# Altium project RB2_My.PrjPcb
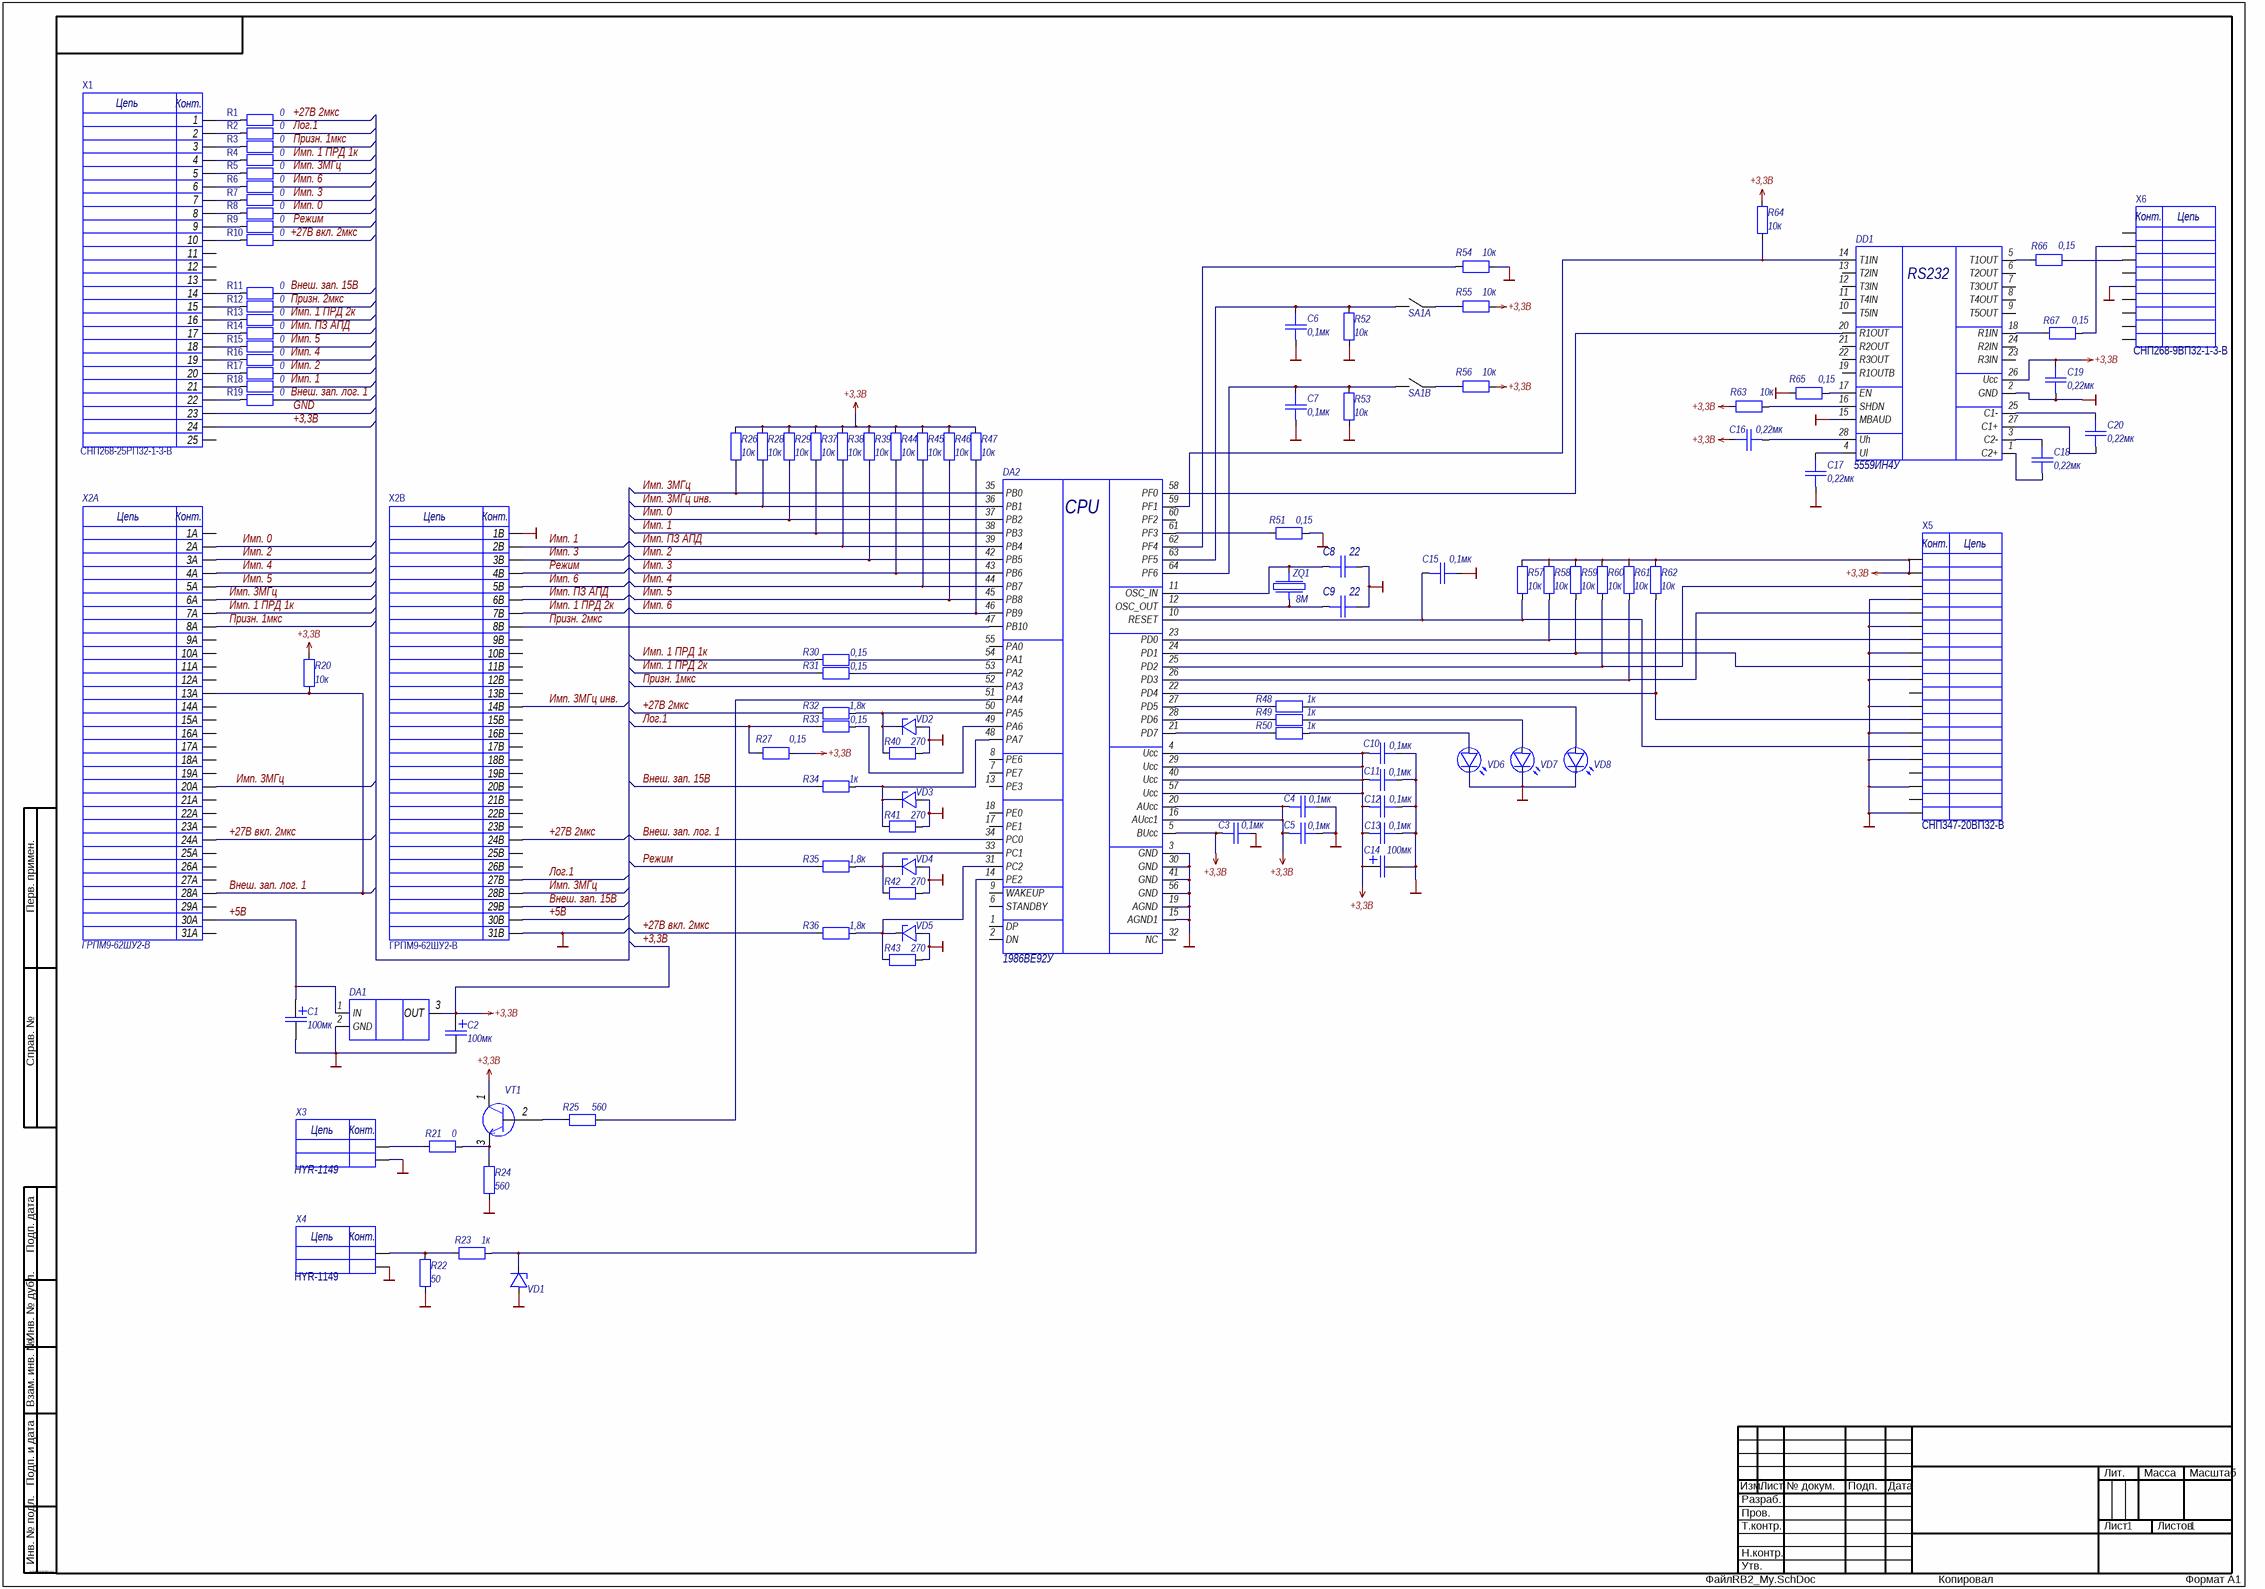
[diagram p0: RB2_My.SchDoc]
1 sheet, 107 parts. Net scope: global (net labels, ports and power ports of the same name join across sheets).
Board file: PCB_RB2_My.PcbDoc

## Sheet RB2_My.SchDoc
size 840 x 594 mm; SheetNumber: 1; SheetTotal: 1

### Parts
C1  value 100мк  [Chip2PinSM127P600-8N(E)]
C2  value 100мк  [Chip2PinSM127P600-8N(E)]
C3  value 0,1мк  [CAPC3419X15N(1206)]
C4  value 0,1мк  [CAPC3419X15N(1206)]
C5  value 0,1мк  [CAPC3419X15N(1206)]
C6  value 0,1мк  [CAPC3419X15N(1206)]
C7  value 0,1мк  [CAPC3419X15N(1206)]
C8  value 22  [CAPC1608X09N (0603)]
C9  value 22  [CAPC1608X09N (0603)]
C10  value 0,1мк  [CAPC3419X15N(1206)]
C11  value 0,1мк  [CAPC3419X15N(1206)]
C12  value 0,1мк  [CAPC3419X15N(1206)]
C13  value 0,1мк  [CAPC3419X15N(1206)]
C14  value 100мк  [Chip2PinSM127P600-8N(E)]
C15  value 0,1мк  [CAPC3419X15N(1206)]
C16  value 0,22мк  [CAPC3419X15N(1206)]
C17  value 0,22мк  [CAPC3419X15N(1206)]
C18  value 0,22мк  [CAPC3419X15N(1206)]
C19  value 0,22мк  [CAPC3419X15N(1206)]
C20  value 0,22мк  [CAPC3419X15N(1206)]
DA1  (no value)  [КТ-28А-2.01]
DA2  1986ВЕ92У  [1986ВЕ92У]
DD1  5559ИН4У  [5559ИН4У]
R1  value 0  [RESC1608X05N (0603)]
R2  value 0  [RESC1608X05N (0603)]
R3  value 0  [RESC1608X05N (0603)]
R4  value 0  [RESC1608X05N (0603)]
R5  value 0  [RESC1608X05N (0603)]
R6  value 0  [RESC1608X05N (0603)]
R7  value 0  [RESC1608X05N (0603)]
R8  value 0  [RESC1608X05N (0603)]
R9  value 0  [RESC1608X05N (0603)]
R10  value 0  [RESC1608X05N (0603)]
R11  value 0  [RESC1608X05N (0603)]
R12  value 0  [RESC1608X05N (0603)]
R13  value 0  [RESC1608X05N (0603)]
R14  value 0  [RESC1608X05N (0603)]
R15  value 0  [RESC1608X05N (0603)]
R16  value 0  [RESC1608X05N (0603)]
R17  value 0  [RESC1608X05N (0603)]
R18  value 0  [RESC1608X05N (0603)]
R19  value 0  [RESC1608X05N (0603)]
R20  value 10к  [RESC1608X05N (0603)]
R21  value 0  [RESC1608X05N (0603)]
R22  value 50  [RESC1608X05N (0603)]
R23  value 1к  [RESC1608X05N (0603)]
R24  value 560  [RESC1608X05N (0603)]
R25  value 560  [RESC1608X05N (0603)]
R26  value 10к  [RESC1608X05N (0603)]
R27  value 0,15  [RESC1608X05N (0603)]
R28  value 10к  [RESC1608X05N (0603)]
R29  value 10к  [RESC1608X05N (0603)]
R30  value 0,15  [RESC1608X05N (0603)]
R31  value 0,15  [RESC1608X05N (0603)]
R32  value 1,8к  [RESC1608X05N (0603)]
R33  value 0,15  [RESC1608X05N (0603)]
R34  value 1к  [RESC1608X05N (0603)]
R35  value 1,8к  [RESC1608X05N (0603)]
R36  value 1,8к  [RESC1608X05N (0603)]
R37  value 10к  [RESC1608X05N (0603)]
R38  value 10к  [RESC1608X05N (0603)]
R39  value 10к  [RESC1608X05N (0603)]
R40  value 270  [RESC1608X05N (0603)]
R41  value 270  [RESC1608X05N (0603)]
R42  value 270  [RESC1608X05N (0603)]
R43  value 270  [RESC1608X05N (0603)]
R44  value 10к  [RESC1608X05N (0603)]
R45  value 10к  [RESC1608X05N (0603)]
R46  value 10к  [RESC1608X05N (0603)]
R47  value 10к  [RESC1608X05N (0603)]
R48  value 1к  [RESC1608X05N (0603)]
R49  value 1к  [RESC1608X05N (0603)]
R50  value 1к  [RESC1608X05N (0603)]
R51  value 0,15  [RESC1608X05N (0603)]
R52  value 10к  [RESC1608X05N (0603)]
R53  value 10к  [RESC1608X05N (0603)]
R54  value 10к  [RESC1608X05N (0603)]
R55  value 10к  [RESC1608X05N (0603)]
R56  value 10к  [RESC1608X05N (0603)]
R57  value 10к  [RESC1608X05N (0603)]
R58  value 10к  [RESC1608X05N (0603)]
R59  value 10к  [RESC1608X05N (0603)]
R60  value 10к  [RESC1608X05N (0603)]
R61  value 10к  [RESC1608X05N (0603)]
R62  value 10к  [RESC1608X05N (0603)]
R63  value 10к  [RESC1608X05N (0603)]
R64  value 10к  [RESC1608X05N (0603)]
R65  value 0,15  [RESC1608X05N (0603)]
R66  value 0,15  [RESC1608X05N (0603)]
R67  value 0,15  [RESC1608X05N (0603)]
SA1  DS1040-02RN  [DS1040-02RN]  (value not drawn)  (parts A,B of 2)
VD1  (no value)  [2С127Д-1]
VD2  (no value)  [2С127Д-1]
VD3  (no value)  [2С127Д-1]
VD4  (no value)  [2С127Д-1]
VD5  (no value)  [2С127Д-1]
VD6  (no value)  [3Л341Б]
VD7  (no value)  [3Л341Б]
VD8  (no value)  [3Л341Б]
VT1  (no value)  [SOT100P230X95-3N (2T368A9)]
X1  СНП268-25РП32-1-3-В  [СНП268-25РП32-1-4-В]
X2  ГРПМ9-62ШУ2-В  [ГРПМ9-62ШУ2-В]  (parts A,B of 2)
X3  HYR-1149  [HYR-1149]
X4  HYR-1149  [HYR-1149]
X5  СНП347-20ВП32-В  [СНП347-20ВП22-В]
X6  СНП268-9ВП32-1-3-В  [СНП268-9ВП32-1-4-В]
ZQ1  value 8М  [РК456]

### Nets
+3,3В: C2.1 C3.1 C4.1 C5.1 C10.1 C11.1 C12.1 C13.1 C14.1 C16.2 C19.2 DA1.3(OUT) DA2.4(Ucc) DA2.5(BUcc) DA2.16(AUcc1) DA2.20(AUcc) DA2.29(Ucc) DA2.40(Ucc) DA2.57(Ucc) DD1.26(Ucc) R20.2 R26.2 R27.2 R28.2 R29.2 R37.2 R38.2 R39.2 R44.2 R45.2 R46.2 R47.2 R55.2 R56.2 R57.1 R58.1 R59.1 R60.1 R61.1 R62.1 R63.1 R64.2 VT1.1 X1.24 X5.1 X5.2
GND: C1.2 C2.2 C3.2 C4.2 C5.2 C6.1 C7.1 C8.2 C9.2 C10.2 C11.2 C12.2 C13.2 C14.2 C15.2 C17.1 C19.1 DA1.2(GND) DA2.3(GND) DA2.15(AGND1) DA2.19(AGND) DA2.30(GND) DA2.41(GND) DA2.56(GND) DD1.2(GND) DD1.15(MBAUD) R22.1 R24.1 R40.2 R41.2 R42.2 R43.2 R51.1 R52.1 R53.1 R54.2 R65.1 VD1.1 VD2.1 VD3.1 VD4.1 VD5.1 VD6.2 VD7.2 VD8.2 X1.23 X2.1B X2.31B X3.2 X4.2 X5.4 X5.6 X5.8 X5.10 X5.12 X5.14 X5.16 X5.18 X5.20 X6.5
+5В: C1.1 DA1.1(IN) X2.30A X2.30B
+27В 2мкс: R1.2 R32.1 X2.24B
+27В вкл. 2мкс: R10.2 R36.1 X2.24A
Внеш. зап. 15В: R11.2 R34.1 X2.29B
Внеш. зап. лог. 1: DA2.34(PC0) R19.2 R20.1 X2.13A X2.28A
Имп. 0: DA2.37(PB2) R8.2 R29.1 X2.2A
Имп. 1: DA2.38(PB3) R18.2 R37.1 X2.2B
Имп. 1 ПРД 1к: R4.2 R30.1 X2.7A
Имп. 1 ПРД 2к: R13.2 R31.1 X2.7B
Имп. 2: DA2.42(PB5) R17.2 R39.1 X2.3A
Имп. 3: DA2.43(PB6) R7.2 R44.1 X2.3B
Имп. 3МГц: DA2.35(PB0) R5.2 R26.1 X2.6A X2.20A X2.28B
Имп. 3МГц инв.: DA2.36(PB1) R28.1 X2.14B
Имп. 4: DA2.44(PB7) R16.2 R45.1 X2.4A
Имп. 5: DA2.45(PB8) R15.2 R46.1 X2.5A
Имп. 6: DA2.46(PB9) R6.2 R47.1 X2.5B
Имп. ПЗ АПД: DA2.39(PB4) R14.2 R38.1 X2.6B
Лог.1: R2.2 R27.1 R33.1 X2.27B
Призн. 1мкс: DA2.52(PA3) R3.2 X2.8A
Призн. 2мкс: DA2.47(PB10) R12.2 X2.8B
Режим: R9.2 R35.1 X2.4B
NetC6_2: C6.2 DA2.63(PF5) R52.2 SA1.2
NetC7_2: C7.2 DA2.64(PF6) R53.2 SA1.4
NetC8_1: C8.1 DA2.11(OSC_IN) ZQ1.2(OSC2)
NetC9_1: C9.1 DA2.12(OSC_OUT) ZQ1.1(OSC1)
NetC15_1: C15.1 DA2.10(RESET) R57.2 X5.15
NetC16_1: C16.1 DD1.28(Uh)
NetC17_2: C17.2 DD1.4(Ul)
NetC18_1: C18.1 DD1.1(C2+)
NetC18_2: C18.2 DD1.3(C2-)
NetC20_1: C20.1 DD1.27(C1+)
NetC20_2: C20.2 DD1.25(C1-)
NetDA2_14: DA2.14(PE2) R23.2 VD1.2
NetDA2_21: DA2.21(PD7) R50.1
NetDA2_22: DA2.22(PD4) R62.2 X5.13
NetDA2_23: DA2.23(PD0) R58.2 X5.7
NetDA2_24: DA2.24(PD1) R59.2 X5.9
NetDA2_25: DA2.25(PD2) R60.2 X5.3
NetDA2_26: DA2.26(PD3) R61.2 X5.5
NetDA2_27: DA2.27(PD5) R48.1
NetDA2_28: DA2.28(PD6) R49.1
NetDA2_31: DA2.31(PC2) R36.2 R43.1 VD5.2
NetDA2_33: DA2.33(PC1) R35.2 R42.1 VD4.2
NetDA2_48: DA2.48(PA7) R34.2 R41.1 VD3.2
NetDA2_49: DA2.49(PA6) R33.2
NetDA2_50: DA2.50(PA5) R32.2 R40.1 VD2.2
NetDA2_51: DA2.51(PA4) R25.1
NetDA2_53: DA2.53(PA2) R31.2
NetDA2_54: DA2.54(PA1) R30.2
NetDA2_58: DA2.58(PF0) DD1.20(R1OUT)
NetDA2_59: DA2.59(PF1) DD1.14(T1IN) R64.1
NetDA2_61: DA2.61(PF3) R51.2
NetDA2_62: DA2.62(PF4) R54.1
NetDD1_5: DD1.5(T1OUT) R66.1
NetDD1_16: DD1.16(SHDN) R63.2
NetDD1_17: DD1.17(EN) R65.2
NetDD1_18: DD1.18(R1IN) R67.1
NetR1_1: R1.1 X1.1
NetR2_1: R2.1 X1.2
NetR3_1: R3.1 X1.3
NetR4_1: R4.1 X1.4
NetR5_1: R5.1 X1.5
NetR6_1: R6.1 X1.6
NetR7_1: R7.1 X1.7
NetR8_1: R8.1 X1.8
NetR9_1: R9.1 X1.9
NetR10_1: R10.1 X1.10
NetR11_1: R11.1 X1.14
NetR12_1: R12.1 X1.15
NetR13_1: R13.1 X1.16
NetR14_1: R14.1 X1.17
NetR15_1: R15.1 X1.18
NetR16_1: R16.1 X1.19
NetR17_1: R17.1 X1.20
NetR18_1: R18.1 X1.21
NetR19_1: R19.1 X1.22
NetR21_1: R21.1 X3.1
NetR21_2: R21.2 R24.2 VT1.3
NetR22_2: R22.2 R23.1 X4.1
NetR25_2: R25.2 VT1.2
NetR48_2: R48.2 VD8.1
NetR49_2: R49.2 VD7.1
NetR50_2: R50.2 VD6.1
NetR55_1: R55.1 SA1.1
NetR56_1: R56.1 SA1.3
NetR66_2: R66.2 X6.3
NetR67_2: R67.2 X6.2

Not connected (* = marked no-connect by the designer): DA2 1(DP) 2(DN) 6(STANDBY) 7(PE7) 8(PE6) 9(WAKEUP) 13(PE3) 17(PE1) 18(PE0) 32(NC) 55(PA0) 60(PF2); DD1 6(T2OUT) 7(T3OUT) 8(T4OUT) 9(T5OUT) 10(T5IN) 11(T4IN) 12(T3IN) 13(T2IN) 19(R1OUTB) 21(R2OUT) 22(R3OUT) 23(R3IN) 24(R2IN); X1 11 12 13 25; X2 1A 9A 9B 10A 10B 11A 11B 12A 12B 13B 14A 15A 15B 16A 16B 17A 17B 18A 18B 19A 19B 20B 21A 21B 22A 22B 23A 23B 25A 25B 26A 26B 27A 29A 31A; X5 11 17 19; X6 1 4 6 7 8 9

### Notes on the sheet
- Перв. примен.
- Справ. №
- Подп. дата
- Инв. № дубл.
- Взам. инв. №
- Подп. и дата
- Изм.
- Разраб.
- Лист
- № докум.
- Подп.
- Дата
- Лит.
- Масса
- Масштаб
- Пров.
- Т.контр.
- Листов
- Инв. № подл.
- Н.контр.
- Утв.
- ALTIUM GOSTBOM2.0 KEV
- Файл:
- Копировал
- Формат А1
- (in symbol 1986ВЕ93) CPU
- (in symbol 5559ИН4У) RS232
- (in symbol GRPM9-62, part A) Цепь; Конт.
- (in symbol GRPM9-62, part B) Цепь; Конт.
- (in symbol SMA) Цепь; Конт.
- (in symbol СНП268-9ВП) Конт.; Цепь
- (in symbol СНП268-25РП) Цепь; Конт.
- (in symbol СНП347-20ВП) Конт.; Цепь

### Library data of the parts
C1 C2 C14 = CapTan: Танталовый конденсатор; manufacture: АЖЯР.673546.004ТУ; name_main: К53-65-16В-; Units: Ф; Footpr: "E"; Name: Танталовый конденсатор
C3-C7 C10-C13 C15 = CapCer: Керамический конденсатор; manufacture: ОЖО.460.107ТУ; nameSuf: -3; name_main: К10-17в-Н90-; Units: Ф; Footpr: 1206; Name: Керамический конденсатор
C8 C9 = CapCer_2: Керамический конденсатор; manufacture: ОЖО.460.107ТУ; Tolerance: 10%; nameSuf: -1; name_main: К10-17в-МПО-; Units: Ф; Footpr: 0603; Name: Керамический конденсатор
C16-C20 = CapCer_1: Керамический конденсатор; manufacture: ОЖО.460.107ТУ; nameSuf: -3; name_main: К10-17в-Н30-; Units: Ф; Footpr: 1206; Name: Керамический конденсатор
DA1 = Stabil: manufacture: АЕЯР.431420.638ТУ; name: Микросхема; name_main: 1303ЕН3.3П
DA2 = 1986ВЕ93: Микроконтроллер; manufacture: АЕЯР.431290.711ТУ; name: Микросхема; name_main: 1986ВЕ92У
DD1 = 5559ИН4У: Приемопередатчик RS232; manufacture: АЕЯР.431230.460ТУ; name: Микросхема; name_main: 5559ИН4У
R1-R19 R21 = Res_1: Резистор; Manufacturer: АЛЯР.434110.005ТУ; Tolerance: 5%; name_main: Р1-12-0,1-; Name: Резистор
R20 R26 R28 R29 R37-R39 R44-R47 R52-R64 = Res_7: Резистор; Manufacturer: АЛЯР.434110.005ТУ; Tolerance: 5%; name_main: Р1-12-0,125-; Units: Ом; Name: Резистор
R22 = Res: Резистор; Manufacturer: АЛЯР.434110.005ТУ; Tolerance: 5%; name_main: Р1-12-0,1-; Name: Резистор
R23 R48-R50 = Res_8: Резистор; Manufacturer: АЛЯР.434110.005ТУ; Tolerance: 5%; name_main: Р1-12-0,125-; Name: Резистор
R24 R25 = Res_3: Резистор; Manufacturer: АЛЯР.434110.005ТУ; Tolerance: 5%; name_main: Р1-12-0,125-; Units: Ом; Name: Резистор
R27 R30 R31 R33 R65-R67 = Res_4: Резистор; Manufacturer: АЛЯР.434110.005ТУ; Tolerance: 5%; name_main: Р1-12-0,1-; Name: Резистор
R32 R35 R36 = Res_5: Резистор; Manufacturer: АЛЯР.434110.005ТУ; Tolerance: 5%; name_main: Р1-12-0,1-; Units: Ом; Name: Резистор
R34 = Res_8: Резистор; Manufacturer: АЛЯР.434110.005ТУ; Tolerance: 5%; name_main: Р1-12-0,1-; Name: Резистор
R40-R43 = Res_6: Резистор; Manufacturer: АЛЯР.434110.005ТУ; Tolerance: 5%; name_main: Р1-12-0,125-; Name: Резистор
R51 = Res_4: Резистор; Manufacturer: АЛЯР.434110.005ТУ; Tolerance: 5%; name_main: Р1-12-0,125-; Name: Резистор
SA1 = Switch: Переключатель; Name: Переключатель; Name_main: DS1040-02RN
VD1-VD5 = 2С127Д-1: manufacture: аА0.339.092ТУ; Name: Стабилитрон; Name_main: 2С133
VD6-VD8 = Led: Индикатор; manufacture: аА0.339.189ТУ; Name: Индикатор; Name_main: 3Л341Б
VT1 = 2Т368А: NPN транзистор; manufacture: аА0.339.092ТУ; Name_main: 2Т368А9; Name: Транзистор
X1 = СНП268-25РП: manufacture: БСАР.430420.014ТУ; name: Разъемы; name_main: СНП268-25РП32-1-3-В
X2 = GRPM9-62: manufacture: Ке0.364.009ТУ; Name: Разъемы; name_main: ГРПМ9-62ШУ2-В
X3 X4 = SMA: manufacture: Чип&Дип; name: Разъемы; name_main: HYR-1149
X5 = СНП347-20ВП: manufacture: РЮМК.430420.012ТУ; name: Разъемы; name_main: СНП347-20ВП32-В
X6 = СНП268-9ВП: manufacture: БСАР.430420.014ТУ; name: Разъемы; name_main: СНП268-9ВП32-1-3-В
ZQ1 = XTAL: Кварцевый резонатор; manufacture: ТУ6321-004-07614320-96; Units: Гц; name_main: РК386-П-8ДТ-8000К; Name: Кварцевый резонатор